# Altium schematic sheet MultiChannelFlex_LED.SchDoc
size A; SheetNumber: 2; SheetTotal: 2
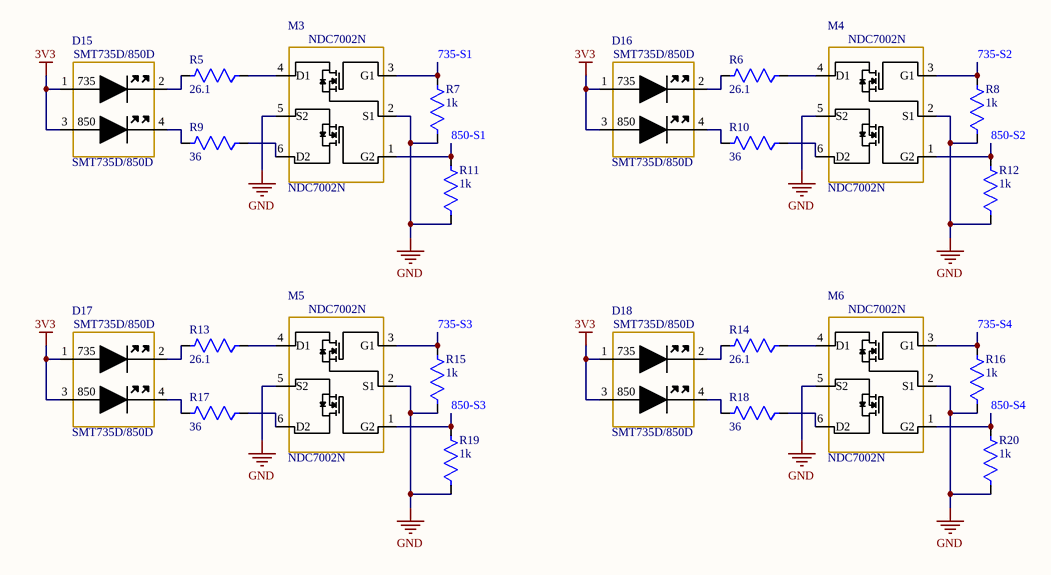
[diagram p0: MultiChannelFlex_LED.SchDoc]

## Parts
D15  SMT735D/850D  [SMT735D_850D]
D16  SMT735D/850D  [SMT735D_850D]
D17  SMT735D/850D  [SMT735D_850D]
D18  SMT735D/850D  [SMT735D_850D]
M3  NDC7002N  [FAIR-MA06A_V]
M4  NDC7002N  [FAIR-MA06A_V]
M5  NDC7002N  [FAIR-MA06A_V]
M6  NDC7002N  [FAIR-MA06A_V]
R5  26.1  [R1206]
R6  26.1  [R1206]
R7  1k  [R1206]
R8  1k  [R1206]
R9  36  [R1206]
R10  36  [R1206]
R11  1k  [R1206]
R12  1k  [R1206]
R13  26.1  [R1206]
R14  26.1  [R1206]
R15  1k  [R1206]
R16  1k  [R1206]
R17  36  [R1206]
R18  36  [R1206]
R19  1k  [R1206]
R20  1k  [R1206]

## Nets
3V3: D15.1 D15.3 D16.1 D16.3 D17.1 D17.3 D18.1 D18.3
GND: M3.2(S1) M3.5(S2) M4.2(S1) M4.5(S2) M5.2(S1) M5.5(S2) M6.2(S1) M6.5(S2) R7.1 R8.1 R11.1 R12.1 R15.1 R16.1 R19.1 R20.1
735-S1: M3.3(G1) R7.2
735-S2: M4.3(G1) R8.2
735-S3: M5.3(G1) R15.2
735-S4: M6.3(G1) R16.2
850-S1: M3.1(G2) R11.2
850-S2: M4.1(G2) R12.2
850-S3: M5.1(G2) R19.2
850-S4: M6.1(G2) R20.2
NetD15_2: D15.2 R5.2
NetD15_4: D15.4 R9.2
NetD16_2: D16.2 R6.2
NetD16_4: D16.4 R10.2
NetD17_2: D17.2 R13.2
NetD17_4: D17.4 R17.2
NetD18_2: D18.2 R14.2
NetD18_4: D18.4 R18.2
NetM3_4: M3.4(D1) R5.1
NetM3_6: M3.6(D2) R9.1
NetM4_4: M4.4(D1) R6.1
NetM4_6: M4.6(D2) R10.1
NetM5_4: M5.4(D1) R13.1
NetM5_6: M5.6(D2) R17.1
NetM6_4: M6.4(D1) R14.1
NetM6_6: M6.6(D2) R18.1

## Notes on the sheet
- (in symbol SMT735D/850D) 735; 850

## Library data of the parts
R5 R6 R13 R14 = RQ73C2B26R1BTD: 1206 26.1 Ohm; Manufacturer: TE; Power Rating: 0.4W; Value: 26.1Ω; Automotive Grade: Grade 0; Voltage Rating: 200V; Temperature Coefficient: 10ppm/°C; Tolerance: 0.1%; Automotive: Yes; Octopart: https://octopart.com/rq73c2b26r1btd-te+connectivity-93911368; Device Class L1: Passive Components; Category: Res; Series: RQ73; Resistance: 26.1Ω; Temperature: -55°C to +155°C; Device Class L3: Chip SMD Resistors; ComponentLink2URL: https://www.te.com/commerce/DocumentDelivery/DDEController?Action=showdoc&DocId=Data+Sheet%7F1773270-2%7FA%7Fpdf%7FEnglish%7FENG_DS_1773270-2_A.pdf%7F9-2176388-167; Composition: Thin Film; Manufacturer Part Number: RQ73C2B26R1BTD; Height: 0.75mm; Lead Free: Yes; Ipc Land Pattern Name: RESC310160X60; Temperature Range High: +155°C; ComponentLink2Description: Datasheet; Temperature Range Low: -55°C; RoHS: TRUE; Device Class L2: Resistors; Package: RQ732B
R7 R8 R11 R12 R15 R16 R19 R20 = RT1206BRD071KL: 1206 1kOhm
R9 R10 R17 R18 = RT1206BRD0736RL: 1206 36 Ohm; Manufacturer: Yageo; Tolerance: 0.1%; Additional Feature: HIGH PRECISION; Rated Power Dissipation (P): 250mW; Rated Temperature: 70°C; Resistance: 36R; Temperature Coefficient: 25ppm/°C; Working Voltage: 200V; Package Height: 0.55mm; Package Length: 3.1mm; Package Width: 1.6mm; Supplier 1: Digikey; Manufacturer Part Number: RT1206BRD0736RL; RoHS: Yes; Category: Chip SMD Resistors; Stock 1: 9860; Pricing 1: 1=0.33, 10=0.241, 50=0.1868, 100=0.166, 500=0.1245, 1000=0.10938 (USD); Mount: Surface Mount; Number of Pins: 2; Size Code: 1206; Min Operating Temperature: -55°C; Max Operating Temperature: 155°C; Resistor Type: FIXED RESISTOR; Construction: Chip; Package Style: SMTMeter; Packaging: Tape and Reel; Technology: THIN FILM; Termination: Wraparound; Reach SVHC Compliant: Yes; RoHS Compliant: Yes; ComponentLink1URL: https://datasheet.ciiva.com:443/pdfs/VipMasterIC/IC/YAGO/YAGO-S-A0008510989/YAGO-S-A0008510989-1.pdf?src-supplier=IHS+Markit; ComponentLink1Description: https://datasheet.ciiva.com:443/pdfs/VipMasterIC/IC/YAGO/YAGO-S-A0008510989/YAGO-S-A0008510989-1.pdf?src-supplier=IHS+Markit; ComponentLink2URL: https://datasheet.ciiva.com/2587/pyu-rt-1-to-0-05-rohs-l-5-2587658.pdf?src-supplier=Digikey; ComponentLink2Description: https://datasheet.ciiva.com/2587/pyu-rt-1-to-0-05-rohs-l-5-2587658.pdf?src-supplier=Digikey; ComponentLink3URL: https://datasheet.ciiva.com/12811/pyu-rt-1-to-0-05-rohs-l-4-12811975.pdf?src-supplier=Mouser; ComponentLink3Description: https://datasheet.ciiva.com/12811/pyu-rt-1-to-0-05-rohs-l-4-12811975.pdf?src-supplier=Mouser